# EAGLE schematic XstractiK_Domination_Player_UpperArm (EAGLE 9.6.2)
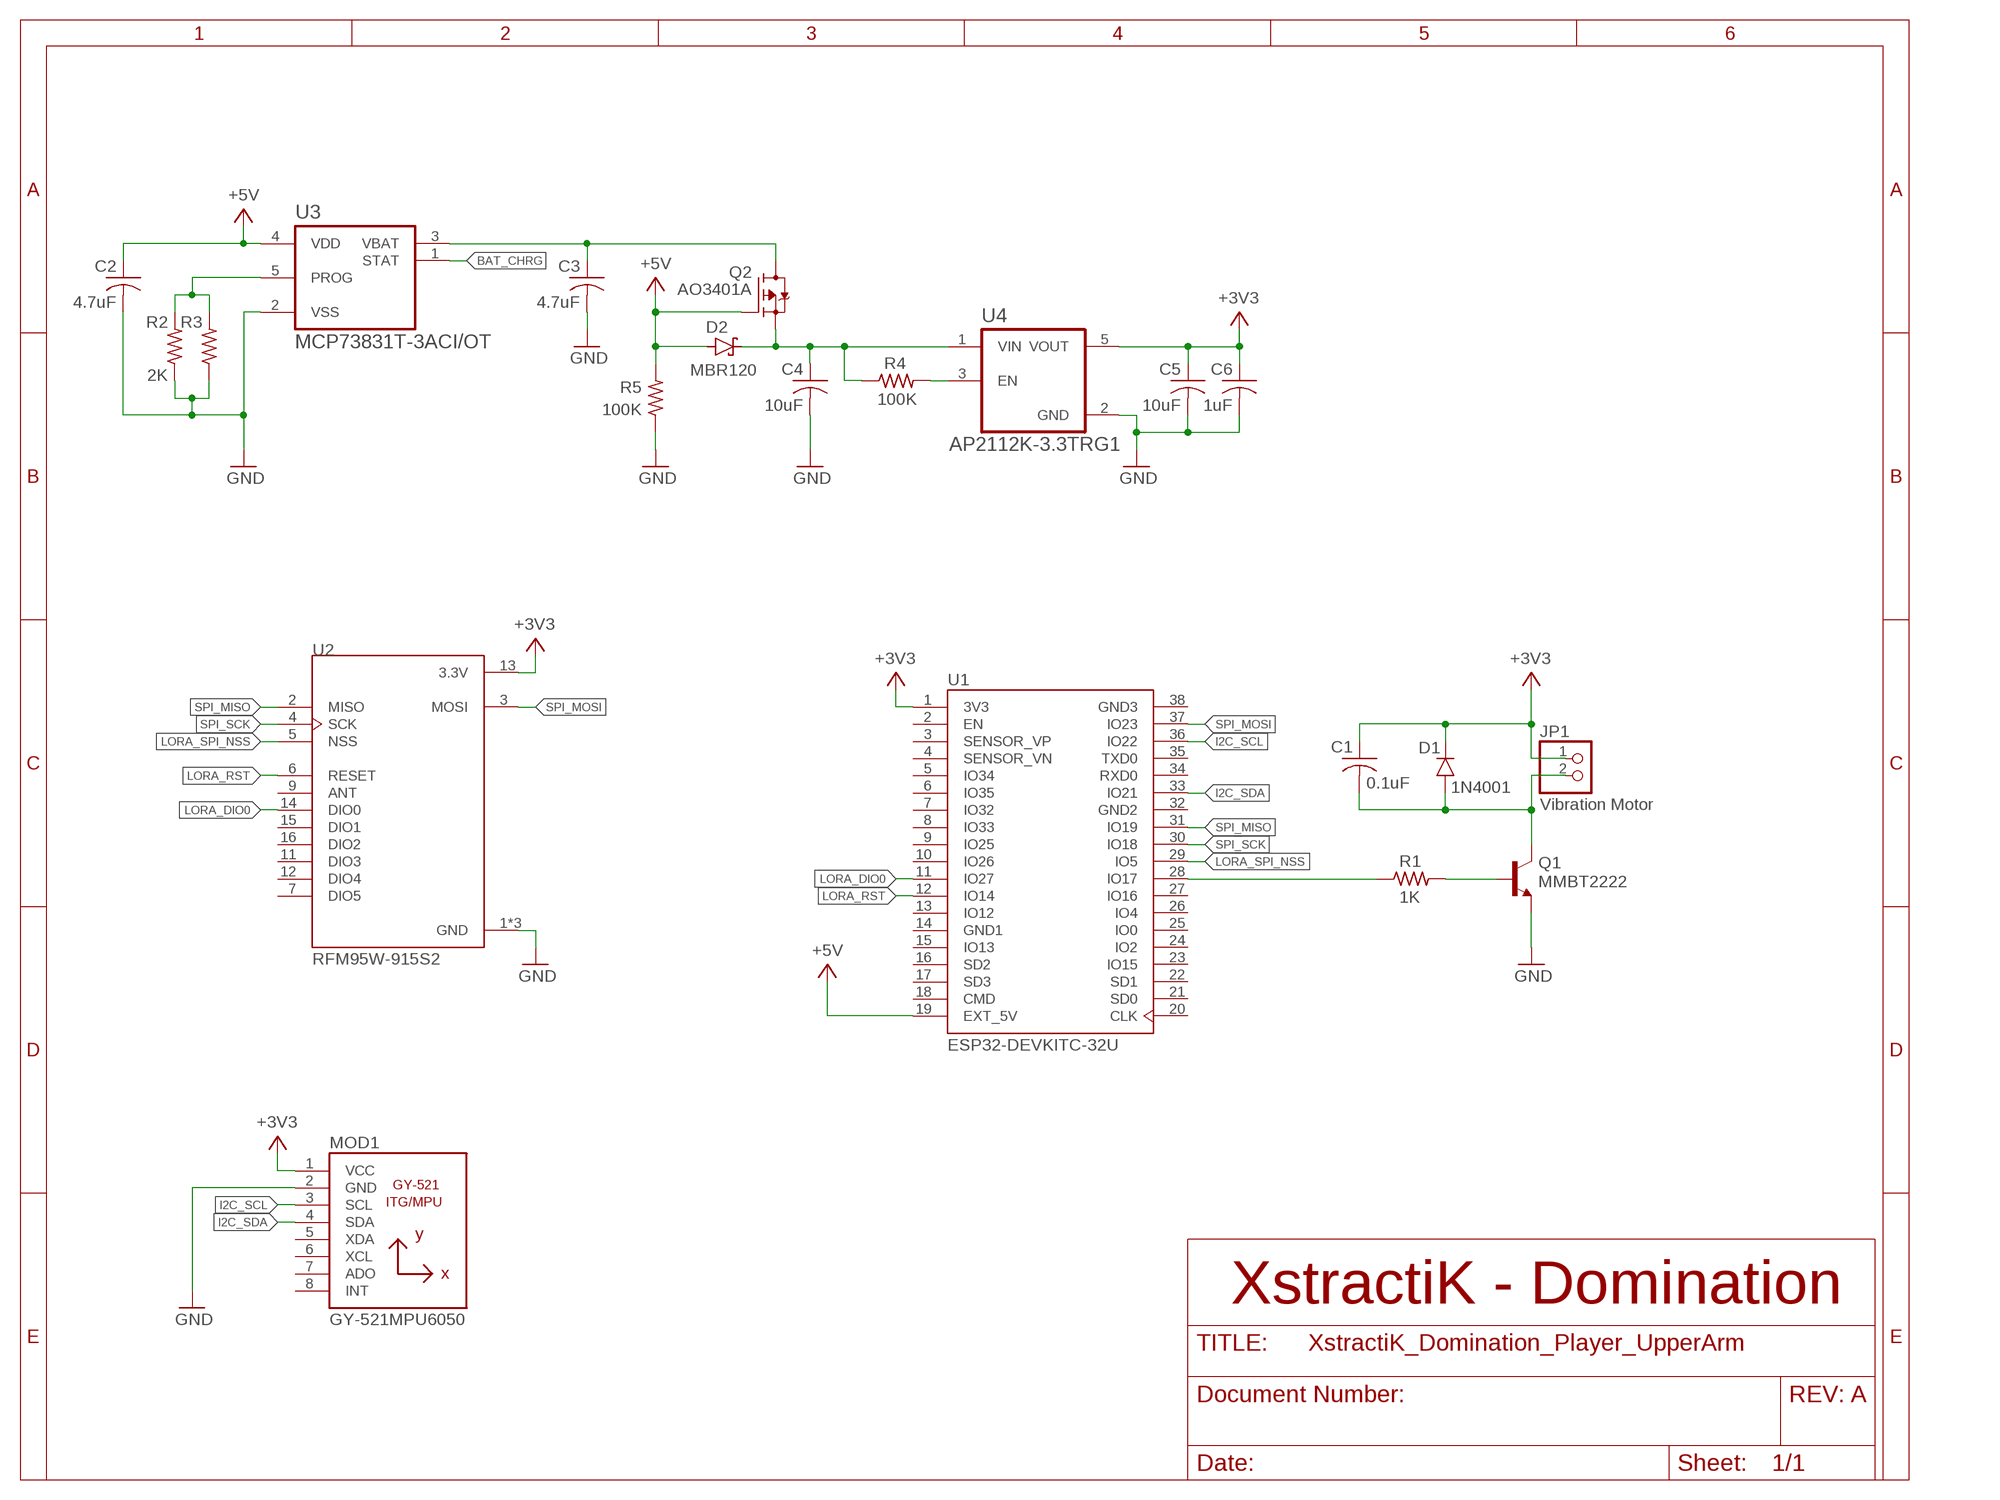
[diagram p0: schematic, sheet 1]

## Parts
C1  0.1uF  C-USC0805  [C0805]
C2  4.7uF  C-USC0805  [C0805]
C3  4.7uF  C-USC0805  [C0805]
C4  10uF  C-USC0805  [C0805]
C5  10uF  C-USC0805  [C0805]
C6  1uF  C-USC0805  [C0805]
D1  1N4001  [DO41-10]
D2  ON_SEMICONDUCTOR_MBR120VLSFT1GON_SEMICONDUCTOR_MBR120VLSFT1G_0_0  [ON_SEMICONDUCTOR_MBR120VLSFT1G_0]
JP1  Vibration Motor  PINHD-1X2  [1X02]
MOD1  GY-521MPU6050  [GY-521]
Q1  MMBT2222  [SOT23-BEC]
Q2  AO3401A  [SOT23-3]
R1  1K  R-US_R0805  [R0805]
R2  2K  R-US_R0805  [R0805]
R3  R-US_R0805  [R0805]
R4  100K  R-US_R0805  [R0805]
R5  100K  R-US_R0805  [R0805]
U1  ESP32-DEVKITC-32U  [MODULE_ESP32-DEVKITC-32U]
U2  RFM95W-915S2  [XCVR_RFM95W-915S2]
U3  MCP73831T-3ACI/OT  [SOT95P270X145-5N]
U4  AP2112K-3.3TRG1  [SOT95P285X140-5N]

## Nets
+3V3: C1.1 C5.1 C6.1 D1.C(CATHODE) JP1.1 MOD1.1(VCC) U1.1(3V3) U2.13(3.3V) U4.5(VOUT)
+5V: C2.1 D2.2(A) Q2.1(G) R5.2 U1.19(EXT_5V) U3.4(VDD)
BAT_CHRG: U3.1(STAT)
CHRG_PROG: R2.2 R3.2 U3.5(PROG)
GND: C2.2 C3.2 C4.2 C5.2 C6.2 MOD1.2(GND) Q1.E R2.1 R3.1 R5.1 U2.1(GND) U2.8(GND) U2.10(GND) U3.2(VSS) U4.2(GND)
I2C_SCL: MOD1.3(SCL) U1.36(IO22)
I2C_SDA: MOD1.4(SDA) U1.33(IO21)
LORA_DIO0: U1.11(IO27) U2.14(DIO0)
LORA_RST: U1.12(IO14) U2.6(RESET)
LORA_SPI_NSS: U1.29(IO5) U2.5(NSS)
N$1: C1.2 D1.A(ANODE) JP1.2 Q1.C
N$2: Q1.B R1.2
N$3: R1.1 U1.28(IO17)
N$4: R4.1
REG_EN: R4.2 U4.3(EN)
REG_VIN: C4.1 D2.1(K) Q2.2(S) U4.1(VIN)
SPI_MISO: U1.31(IO19) U2.2(MISO)
SPI_MOSI: U1.37(IO23) U2.3(MOSI)
SPI_SCK: U1.30(IO18) U2.4(SCK)
VBAT: C3.1 Q2.3(D) U3.3(VBAT)
Unconnected: MOD1.5(XDA) MOD1.6(XCL) MOD1.7(ADO) MOD1.8(INT) U1.2(EN) U1.3(SENSOR_VP) U1.4(SENSOR_VN) U1.5(IO34) U1.6(IO35) U1.7(IO32) U1.8(IO33) U1.9(IO25) U1.10(IO26) U1.13(IO12) U1.15(IO13) U1.16(SD2) U1.17(SD3) U1.18(CMD) U1.20(CLK) U1.21(SD0) U1.22(SD1) U1.23(IO15) U1.24(IO2) U1.25(IO0) U1.26(IO4) U1.27(IO16) U1.34(RXD0) U1.35(TXD0) U2.7(DIO5) U2.9(ANT) U2.11(DIO3) U2.12(DIO4) U2.15(DIO1) U2.16(DIO2)

## Notes on the sheet
- XstractiK - Domination
- A

## Power pins joined to a net without a drawn wire
GND1: U1.14(GND1)
GND2: U1.32(GND2)
GND3: U1.38(GND3)

## Library data of the parts
C1-C6 = rcl:C-US: CAPACITOR, American symbol; SPICEPREFIX: C
D1 = 1N4001:1N4001: DIODE general purpose rectifier, 1 A Check availability <https://pricing.snapeda.com/parts/1N4001/Diotec%20Semiconductor/view-part?ref=eda>; AVAILABILITY: In Stock; DESCRIPTION: Diode Standard 50 V 1A Through Hole DO-41/DO-204AC; MF: Diotec Semiconductor; MP: 1N4001; PACKAGE: DO-41 Diotec; PRICE: None; PURCHASE-URL: https://pricing.snapeda.com/search/part/1N4001/?ref=eda
D2 = MBR120VLSFT1G:ON_SEMICONDUCTOR_MBR120VLSFT1G: ONSC-D-K1A2-2_A; COMPONENT_LINK_1_DESCRIPTION: Manufacturer URL; COMPONENT_LINK_1_URL: http://www.onsemi.com/; COMPONENT_LINK_3_DESCRIPTION: Package Specification; COMPONENT_LINK_3_URL: http://www.onsemi.cn/pub_link/Collateral/MBR120VLSFT1-D.PDF; CONFIGURATION: Single; DATASHEET: http://www.onsemi.cn/pub_link/Collateral/MBR120VLSFT1-D.PDF; DATASHEET_VERSION: Rev. 2; IFSM_MAX_A: 45; IMPORTED: yes; IMPORTED_FROM: vault; IMPORT_TS: 1521178043; MF: On Semiconductor; MOUNTING_TECHNOLOGY: Surface Mount; MPN: MBR120VLSFT1G; PACKAGE: SOD-123FL-2-498-01; PACKAGE_DESCRIPTION: 2-Pin SOD, Body 1.65 x 2.7 mm; PACKAGE_VERSION: Rev. A; PACKING: Tape and Reel; PREFIX: D; ROHS: Yes; VAULT_GUID: 4A61E613-4CE2-4B75-A462-25A6CC2A8907; VAULT_REVISION: 780FB999-FC13-4133-9298-794FC10DBA1F
JP1 = pinhead:PINHD-1X2: PIN HEADER
MOD1 = MPU6050:GY-521: GY-521 PIM for MPU6050 Check availability <https://pricing.snapeda.com/parts/GY-521/GODREAM%20FORDREAM%20CO.%2C%20LIMITED/view-part?ref=eda>; AVAILABILITY: Not in stock; DESCRIPTION: Triple Axis Accelerometer Gyro Breakout; MF: GODREAM FORDREAM CO., LIMITED; MP: GY-521; PACKAGE: Package; PRICE: None
Q1 = MMBT2222:MMBT2222*: NPN Transistor Check availability <https://pricing.snapeda.com/parts/MMBT2222/ON%20Semiconductor/view-part?ref=eda>; AVAILABILITY: In Stock; DESCRIPTION: Bipolar (BJT) Transistor NPN 30 V 600 mA 250MHz 300 mW Surface Mount SOT-23-3 (TO-236); MF: ON Semiconductor; MP: MMBT2222; PACKAGE: SOT-23-3 Fairchild Semiconductor; PRICE: None; PURCHASE-URL: https://pricing.snapeda.com/search/part/MMBT2222/?ref=eda
Q2 = AO3401A:AO3401A: Tipo de transistor P-MOSFET Polarización unipolar Tensión drenaje-fuente -30V Corriente del drenaje -4A Poder disipado 1.4W Carcasa SOT23 Tensión puerta-fuente ±12V Check availability <https://pricing.snapeda.com/parts/AO3401A/Alpha%20%26%20Omega%20Semiconductor%20Inc./view-part?ref=eda>; AVAILABILITY: In Stock; DESCRIPTION: P-Channel 30 V 4A (Ta) 1.4W (Ta) Surface Mount SOT-23-3; MF: Alpha & Omega Semiconductor Inc.; MP: AO3401A; PACKAGE: TO-236-3 Alpha &amp; Omega Semiconductor Inc.; PRICE: None; PURCHASE-URL: https://pricing.snapeda.com/search/part/AO3401A/?ref=eda
R1-R5 = rcl:R-US_: RESISTOR, American symbol; SPICEPREFIX: R
U1 = ESP32-DEVKITC-32U:ESP32-DEVKITC-32U: ESP32-DEVKITC Check availability <https://pricing.snapeda.com/parts/ESP32-DEVKITC-32U/Espressif%20Systems/view-part?ref=eda>; AVAILABILITY: In Stock; DESCRIPTION: ESP32-WROOM-32UE series Transceiver; 802.11 b/g/n (Wi-Fi, WiFi, WLAN), Bluetooth® Smart Ready 4.x Dual Mode Evaluation Board; MF: Espressif Systems; MP: ESP32-DEVKITC-32U; PACKAGE: None; PRICE: None; PURCHASE-URL: https://pricing.snapeda.com/search/part/ESP32-DEVKITC-32U/?ref=eda
U2 = RFM95W-915S2:RFM95W-915S2: RFM95(W) - Low Power Long Range Transceiver Module V1.0 Check availability <https://pricing.snapeda.com/parts/RFM95W-915S2/RF%20Solutions/view-part?ref=eda>; AVAILABILITY: In Stock; DESCRIPTION: 802.15.4 LoRa™ Transceiver Module 915MHz Antenna Not Included Surface Mount; MF: RF Solutions; MP: RFM95W-915S2; PACKAGE: SMD-16 RF Solutions; PRICE: None; PURCHASE-URL: https://pricing.snapeda.com/search/part/RFM95W-915S2/?ref=eda
U3 = MCP73831T-3ACI_OT:MCP73831T-3ACI/OT: Li-Polymer Charge Management Controllers, SOT23-5 Check availability <https://pricing.snapeda.com/parts/MCP73831T-3ACI/OT/Microchip/view-part?ref=eda>; AVAILABILITY: In Stock; DESCRIPTION: Charger IC Lithium Ion/Polymer SOT-23-5; MF: Microchip; MP: MCP73831T-3ACI/OT; PACKAGE: SOT-23-5 Microchip; PRICE: None; PURCHASE-URL: https://pricing.snapeda.com/search/part/MCP73831T-3ACI/OT/?ref=eda
U4 = AP2112K-3.3TRG1:AP2112K-3.3TRG1: AP2112 Series 0.6 A 3.3 V Fixed Output SMT LDO Linear Regulator - SOT23-5 Check availability <https://pricing.snapeda.com/parts/AP2112K-3.3TRG1/Diodes%20Inc./view-part?ref=eda>; AVAILABILITY: In Stock; DESCRIPTION: Linear Voltage Regulator IC Positive Fixed 1 Output 600mA SOT-25; MF: Diodes Inc.; MP: AP2112K-3.3TRG1; PACKAGE: SOT-753 Diodes Inc.; PRICE: None; PURCHASE-URL: https://pricing.snapeda.com/search/part/AP2112K-3.3TRG1/?ref=eda